# EAGLE board Star Motherboard V4 (EAGLE 9.6.2), part 1 of 2
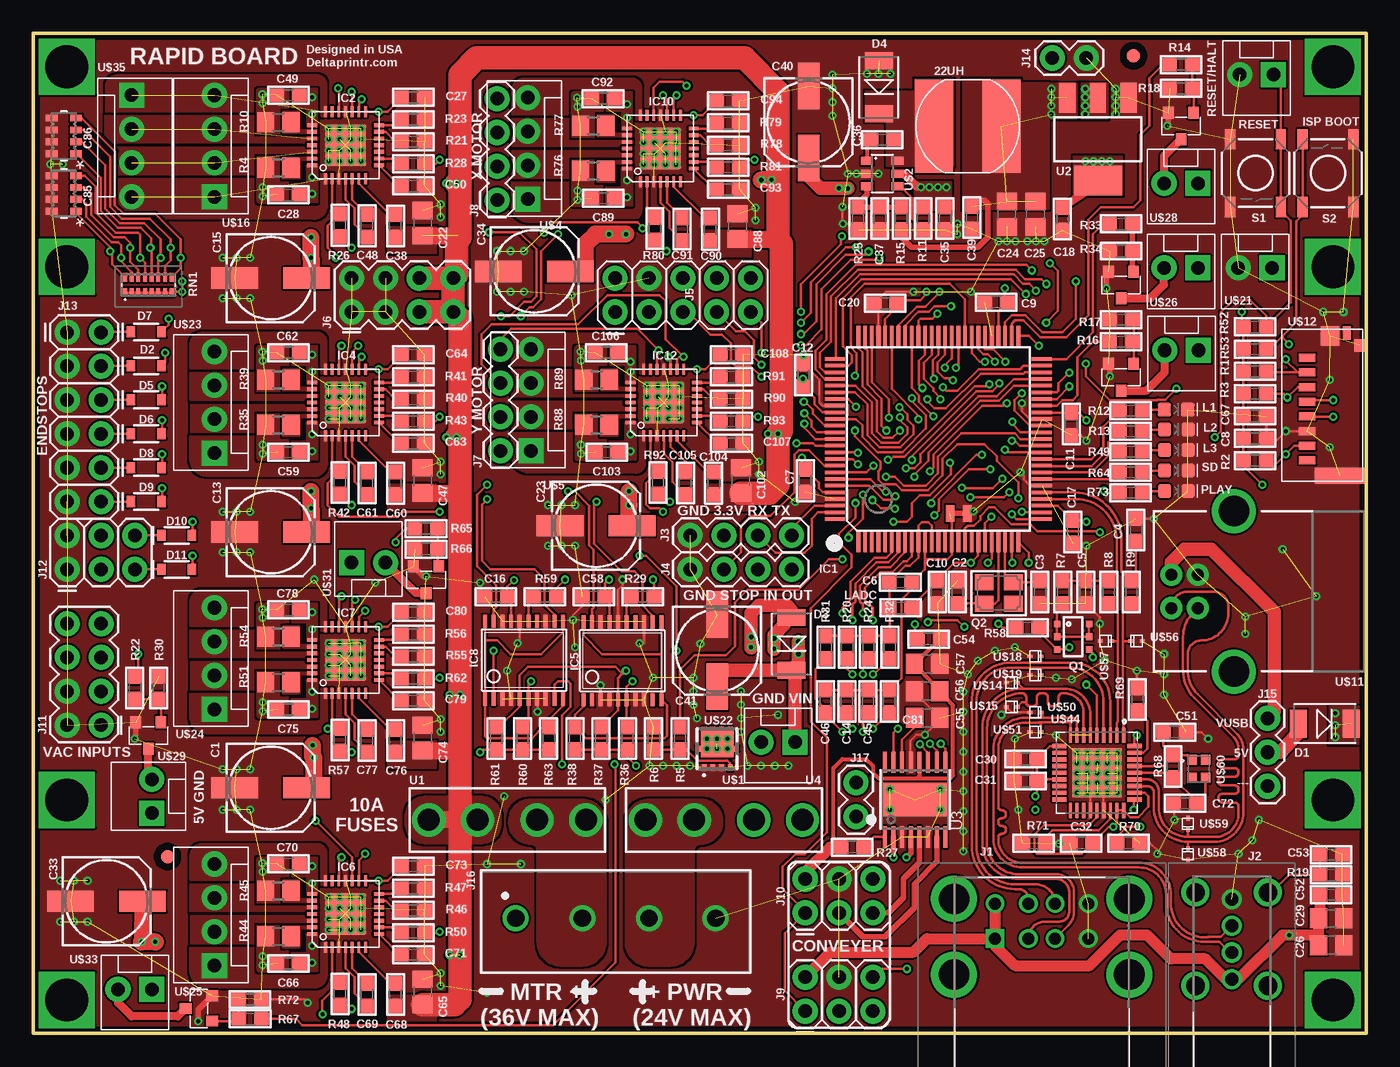
[diagram p9: board, top side]
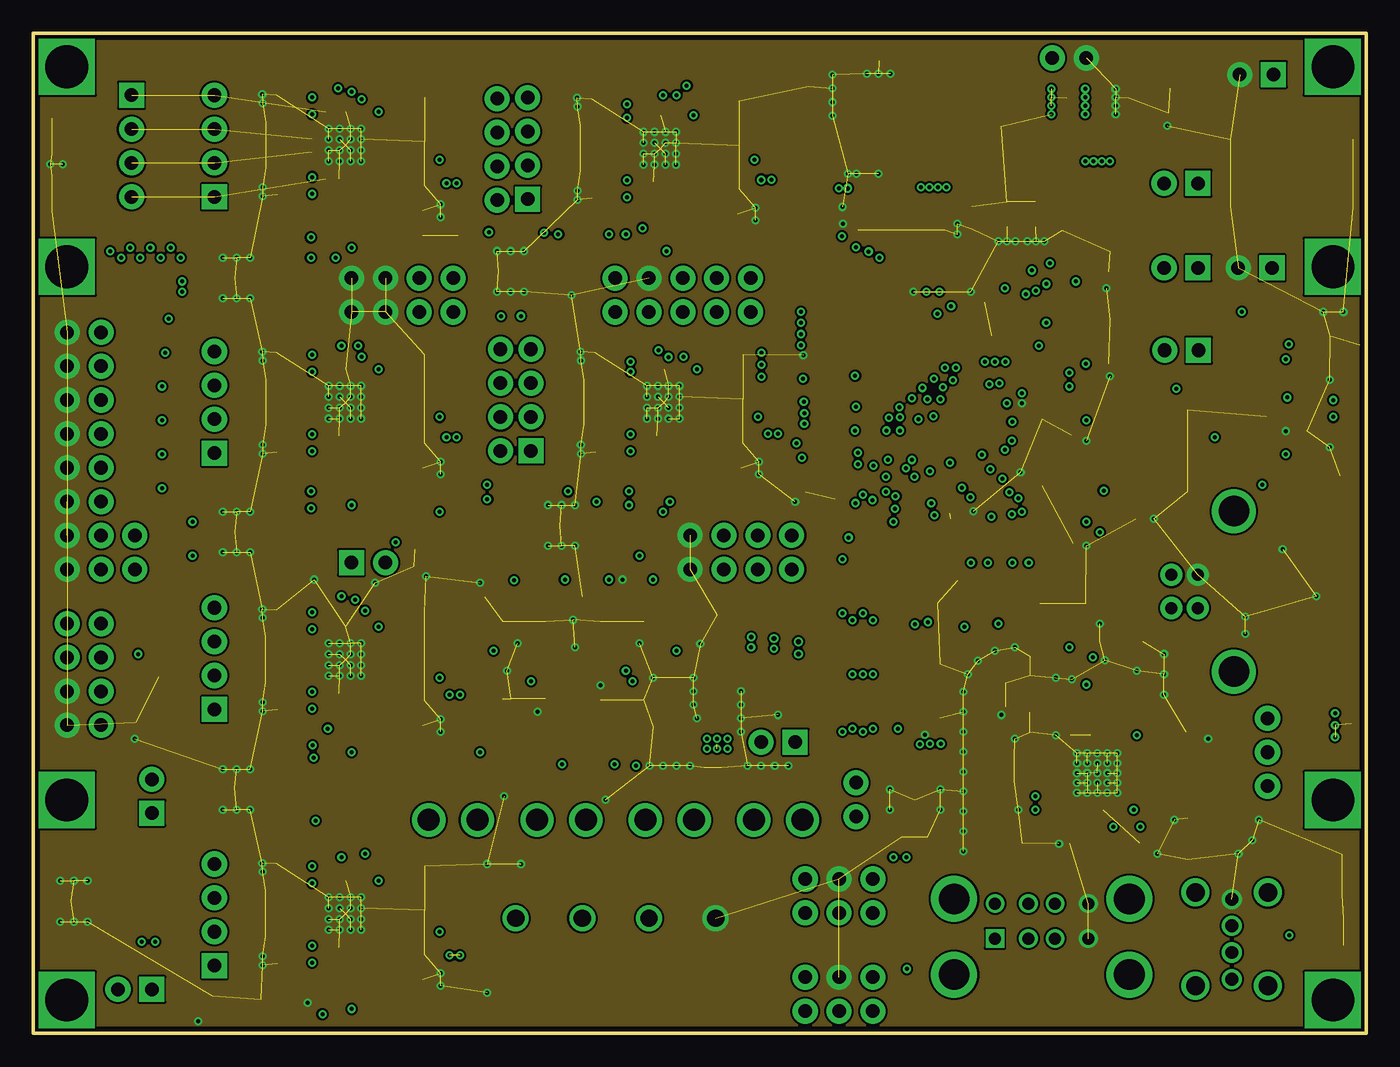
[diagram p10: board, inner layer GND]
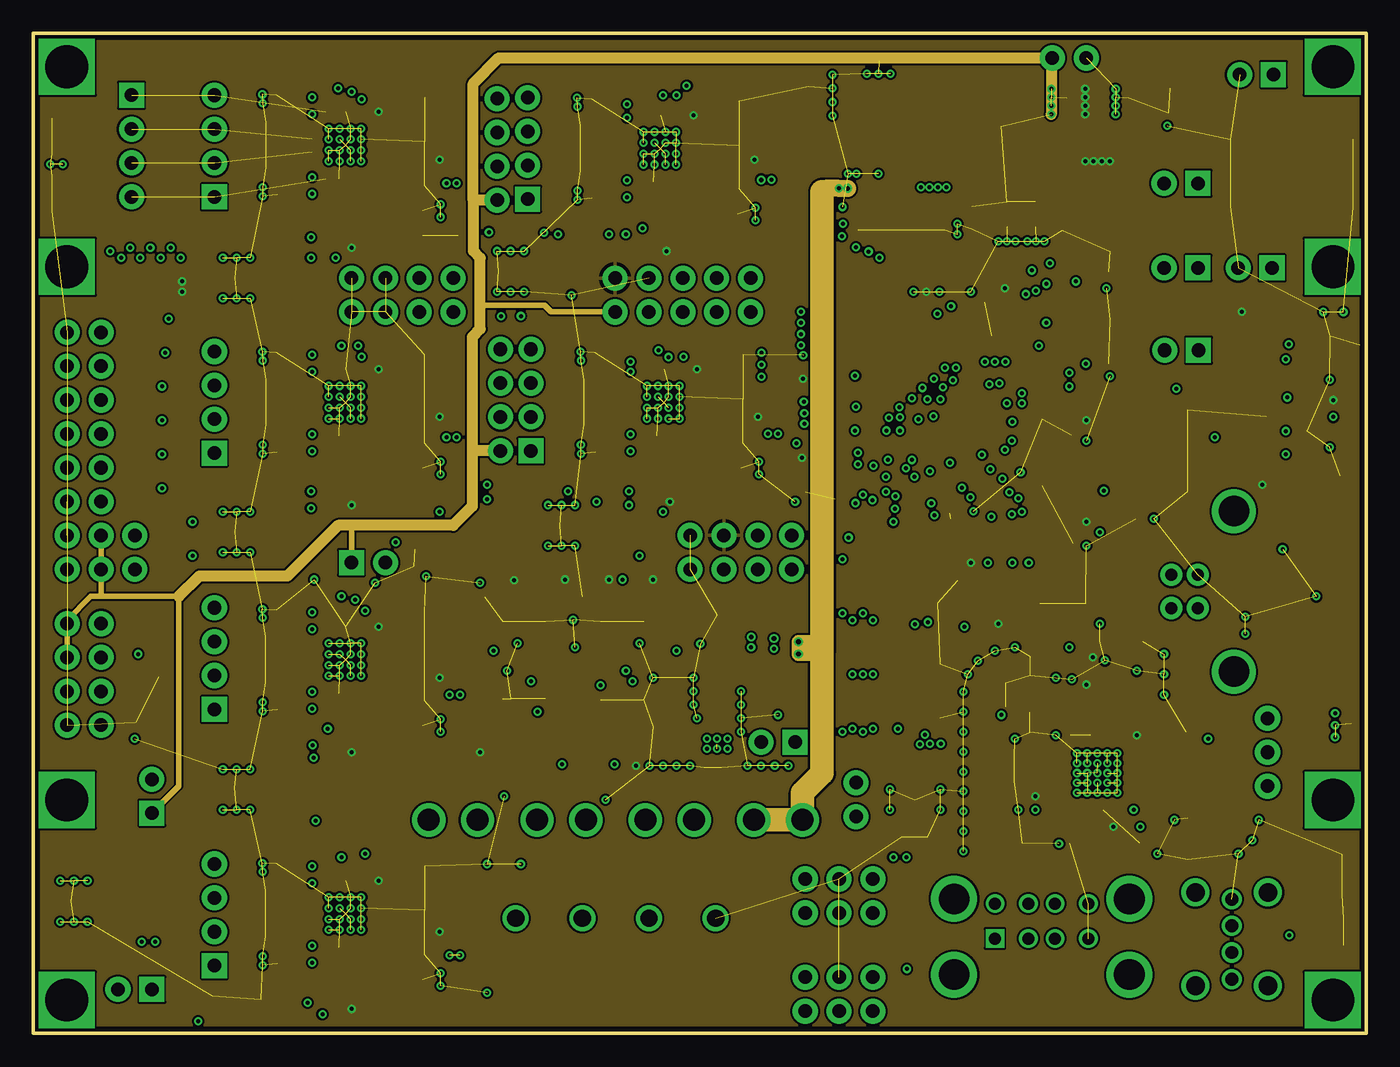
[diagram p11: board, inner layer VCC]
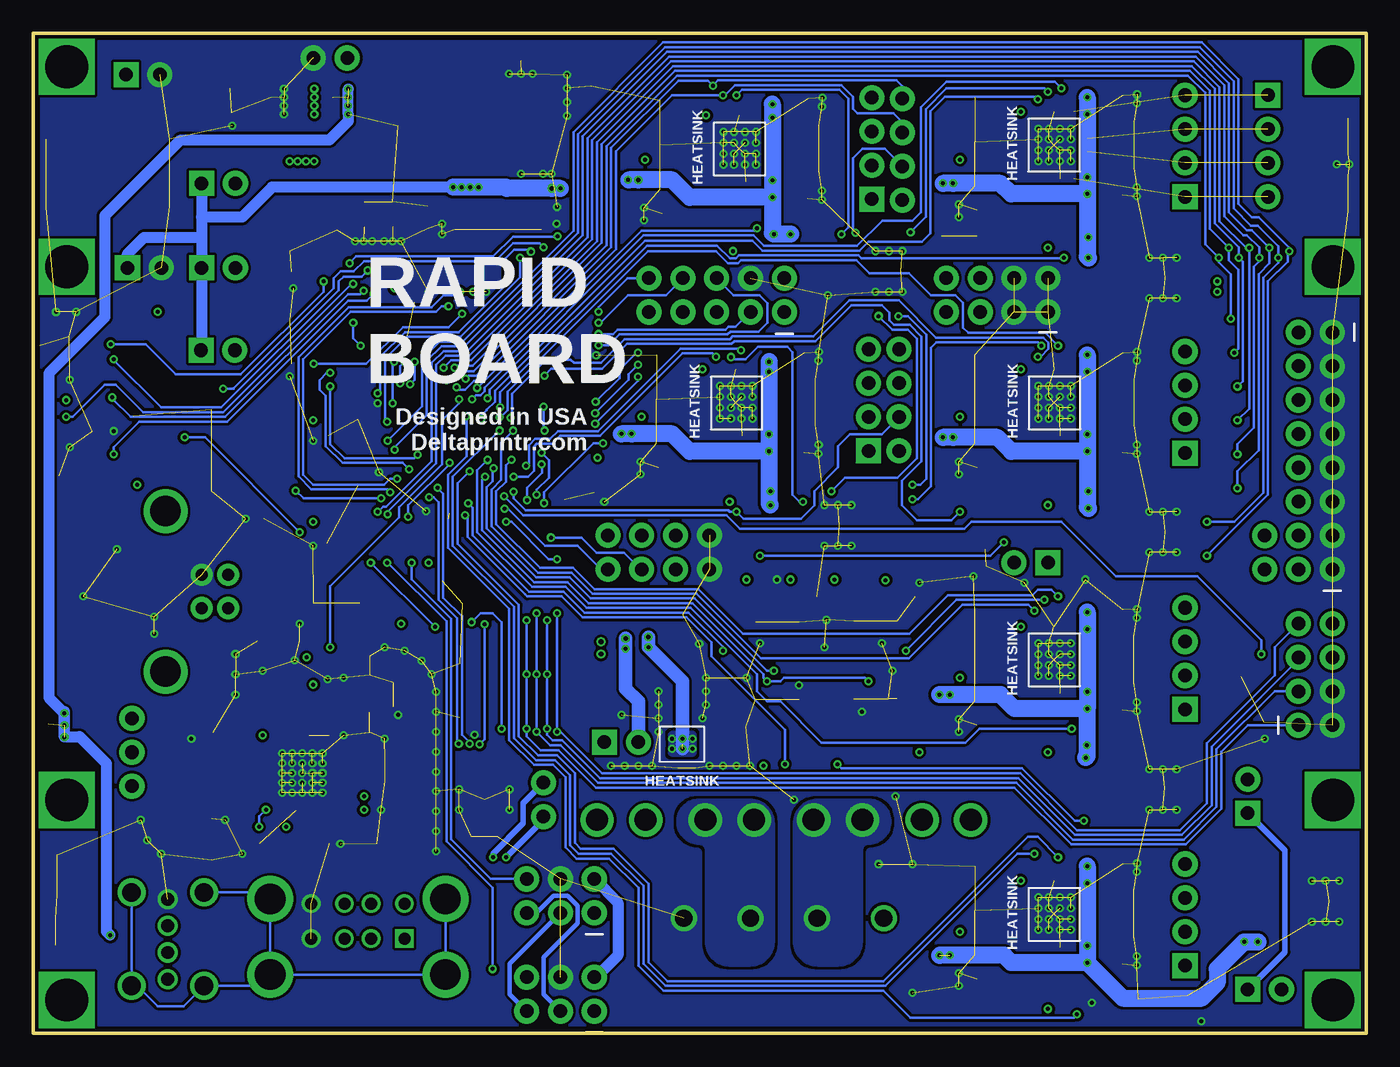
[diagram p12: board, bottom side, seen from below]

Size 100 x 75 mm. Coordinates in mm from the lower left corner, seen from the top.
Outline: 0,75 0,0 100,0 100,75 0,75
Copper layers (1*2*15*16): Top 0.035559375mm / dielectric 0.17018125mm / GND 0.01778125mm / dielectric 47mil / VCC 0.01778125mm / dielectric 0.17018125mm / Bottom 0.035559375mm
Design rules "OSHPark-4layer": minimum track width 6mil, minimum drill 0.3mm, track to track 6mil, track to pad 6mil, pad to pad 6mil, via to via 6mil, smd to smd 0mil, copper to edge 15mil, drill to drill 6mil, minimum pad ring 4mil, minimum via ring 6mil, stop-mask expansion 2.5mil, vias tented up to drill 20mil, thermal gap 10mil
Net classes: 1 DP/DM: width 0.203 mm; 5 3.3-Amp Class: width 1.27 mm

## Footprints (pad centres in the part's own frame; a part is rotated, then mirrored left to right if it is on the bottom)
CD75 = smd 7 x 2.85: 1 0,2.54; 2 0,-2.54
153CLV-0605 = smd 3.5 x 1.6: + 2.7,0; - -2.7,0
CAP_0603 = smd 1.1 x 1: 1 -0.85,0; 2 0.85,0
C0805 = smd 1.3 x 1.5: 1 -0.95,0; 2 0.95,0
CA064_KEM = smd 0.889 x 0.508: 1 -0.914,1.333; 2 -0.914,0.445; 3 -0.914,-0.445; 4 -0.914,-1.333; 5 0.914,-1.333; 6 0.914,-0.445; 7 0.914,0.445; 8 0.914,1.333
DO-214AC = smd 1.27 x 2.1: 1 -1.98,0; 2 1.98,0
SOD-323 = smd 0.63 x 0.83: A 1.15,0; C -1.15,0
LPC1769 = smd 0.27 x 1.5: 1 -6,-7.75; 2 -5.5,-7.75; 3 -5,-7.75; 4 -4.5,-7.75; 5 -4,-7.75; 6 -3.5,-7.75; 7 -3,-7.75; 8 -2.5,-7.75; 9 -2,-7.75; 10 -1.5,-7.75; 11 -1,-7.75; 12 -0.5,-7.75; 13 0,-7.75; 14 0.5,-7.75; 15 1,-7.75; 16 1.5,-7.75; 17 2,-7.75; 18 2.5,-7.75; 19 3,-7.75; 20 3.5,-7.75; 21 4,-7.75; 22 4.5,-7.75; 23 5,-7.75; 24 5.5,-7.75; 25 6,-7.75; 51 6,7.75; 52 5.5,7.75; 53 5,7.75; 54 4.5,7.75; 55 4,7.75; 56 3.5,7.75; 57 3,7.75; 58 2.5,7.75; 59 2,7.75; 60 1.5,7.75; 61 1,7.75; 62 0.5,7.75; 63 0,7.75; 64 -0.5,7.75; 65 -1,7.75; 66 -1.5,7.75; 67 -2,7.75; 68 -2.5,7.75; 69 -3,7.75; 70 -3.5,7.75; 71 -4,7.75; 72 -4.5,7.75; 73 -5,7.75; 74 -5.5,7.75; 75 -6,7.75 | smd 1.5 x 0.27: 26 7.75,-6; 27 7.75,-5.5; 28 7.75,-5; 29 7.75,-4.5; 30 7.75,-4; 31 7.75,-3.5; 32 7.75,-3; 33 7.75,-2.5; 34 7.75,-2; 35 7.75,-1.5; 36 7.75,-1; 37 7.75,-0.5; 38 7.75,0; 39 7.75,0.5; 40 7.75,1; 41 7.75,1.5; 42 7.75,2; 43 7.75,2.5; 44 7.75,3; 45 7.75,3.5; 46 7.75,4; 47 7.75,4.5; 48 7.75,5; 49 7.75,5.5; 50 7.75,6; 76 -7.75,6; 77 -7.75,5.5; 78 -7.75,5; 79 -7.75,4.5; 80 -7.75,4; 81 -7.75,3.5; 82 -7.75,3; 83 -7.75,2.5; 84 -7.75,2; 85 -7.75,1.5; 86 -7.75,1; 87 -7.75,0.5; 88 -7.75,0; 89 -7.75,-0.5; 90 -7.75,-1; 91 -7.75,-1.5; 92 -7.75,-2; 93 -7.75,-2.5; 94 -7.75,-3; 95 -7.75,-3.5; 96 -7.75,-4; 97 -7.75,-4.5; 98 -7.75,-5; 99 -7.75,-5.5; 100 -7.75,-6
QFN28-PAD = smd 0.8 x 0.26: 1 -2.5,1.5; 2 -2.5,1; 3 -2.5,0.5; 4 -2.5,0; 5 -2.5,-0.5; 6 -2.5,-1; 7 -2.5,-1.5; 15 2.5,-1.5; 16 2.5,-1; 17 2.5,-0.5; 18 2.5,0; 19 2.5,0.5; 20 2.5,1; 21 2.5,1.5 | smd 0.26 x 0.8: 8 -1.5,-2.5; 9 -1,-2.5; 10 -0.5,-2.5; 11 0,-2.5; 12 0.5,-2.5; 13 1,-2.5; 14 1.5,-2.5; 22 1.5,2.5; 23 1,2.5; 24 0.5,2.5; 25 0,2.5; 26 -0.5,2.5; 27 -1,2.5; 28 -1.5,2.5 | smd 3.1 x 3.1: TP 0,0
TSSOP20 = smd 0.305 x 0.991: 1 -2.925,-2.918; 2 -2.275,-2.918; 3 -1.625,-2.918; 4 -0.975,-2.918; 5 -0.325,-2.918; 6 0.325,-2.918; 7 0.975,-2.918; 8 1.625,-2.918; 9 2.275,-2.918; 10 2.925,-2.918; 11 2.925,2.918; 12 2.275,2.918; 13 1.625,2.918; 14 0.975,2.918; 15 0.325,2.918; 16 -0.325,2.918; 17 -0.975,2.918; 18 -1.625,2.918; 19 -2.275,2.918; 20 -2.925,2.918
C2341 = drill 0.9 pad 1.4 square: 1 0,0 | drill 0.9 pad 1.4: 2 2.5,0; 3 4.5,0; 4 7,0; 5 7,2.62; 6 4.5,2.62; 7 2.5,2.62; 8 0,2.62 | drill 2.3 pad 3.45: MH1 -3.07,-2.71; MH2 10.07,-2.71; MH3 10.07,2.97; MH4 -3.07,2.97
737250110BLF = drill 0.97 pad 1.509: 1 0,0; 2 0,2; 3 0,4; 4 0,6 | drill 1.4 pad 2.1: MH1 -2.72,6.5; MH2 2.72,6.5; MH3 2.72,-0.5; MH4 -2.72,-0.5
1X04 = drill 1.016 pad 1.88: 1 0,0; 2 2.54,0; 3 5.08,0; 4 7.62,0
2X5 = drill 1.016 pad 1.88: 1 0,0; 2 0,2.54; 3 2.54,0; 4 2.54,2.54; 5 5.08,0; 6 5.08,2.54; 7 7.62,0; 8 7.62,2.54; 9 10.16,0; 10 10.16,2.54
2X4 = drill 1.016 pad 1.88: 1 -3.81,-1.27; 2 -3.81,1.27; 3 -1.27,-1.27; 4 -1.27,1.27; 5 1.27,-1.27; 6 1.27,1.27; 7 3.81,-1.27; 8 3.81,1.27
2X3 = drill 1.016 pad 1.88: 1 0,0; 2 0,2.54; 3 2.54,0; 4 2.54,2.54; 5 5.08,0; 6 5.08,2.54
2X6 = drill 1.016 pad 1.88: 1 0,0; 2 0,2.54; 3 2.54,0; 4 2.54,2.54; 5 5.08,0; 6 5.08,2.54; 7 7.62,0; 8 7.62,2.54; 9 10.16,0; 10 10.16,2.54; 11 12.7,0; 12 12.7,2.54
1X02 = drill 1.016 pad 1.88: 1 0,0; 2 2.54,0
1X03 = drill 1.016 pad 1.88: 1 0,0; 2 2.54,0; 3 5.08,0
691137710004 = drill 1.3: 1 -7.5,0; 2 -2.5,0; 3 2.5,0; 4 7.5,0
LED-0603 = smd 1 x 1: A -0.877,0; C 0.877,0
SC74_INFINEON = smd 0.5 x 0.5: 1 -0.95,-1.2; 2 0,-1.2; 3 0.95,-1.2; 4 0.95,1.2; 5 0,1.2; 6 -0.95,1.2
CRYSTAL_3.2X2.5 = smd 1.4 x 1.2: 1 -1.1,-0.8; 2 1.1,0.8; GND1 -1.1,0.8; GND2 1.1,-0.8
RESISTOR_0603 = smd 1.1 x 1: 1 -0.85,0; 2 0.85,0
R0805 = smd 1.3 x 1.5: 1 -0.95,0; 2 0.95,0
YC248JR0710KL = smd 0.3 x 0.65: 1 -1.75,-0.575; 2 -1.75,0.575; 3 -1.25,-0.575; 4 -1.25,0.575; 5 -0.75,-0.575; 6 -0.75,0.575; 7 -0.25,-0.575; 8 -0.25,0.575; 9 0.25,-0.575; 10 0.25,0.575; 11 0.75,-0.575; 12 0.75,0.575; 13 1.25,-0.575; 14 1.25,0.575; 15 1.75,-0.575; 16 1.75,0.575
SWITCH_MOMENTARY = smd 1.524 x 0.762: 1 -2.54,1.905; 2 2.54,1.905; 3 -2.54,-1.905; 4 2.54,-1.905
2PT_GND_TIE = smd 1.27 x 0.635: P$1 0,0.635; P$2 0,-0.635
3544-2 = drill 1.65 pad 2.5: 1 -5.895,0; 2 -2.235,0; 3 2.235,0; 4 5.895,0
SOT223 = smd 1.219 x 2.235: 1 -2.311,-3.099; 2 0,-3.099; 3 2.311,-3.099 | smd 3.6 x 2.2: 4 0,3.099
DRV8833 = smd 0.3 x 1.6: P$1 -2.275,-2.8; P$2 -1.625,-2.8; P$3 -0.975,-2.8; P$4 -0.325,-2.8; P$5 0.325,-2.8; P$6 0.975,-2.8; P$7 1.625,-2.8; P$8 2.275,-2.8; P$9 2.275,2.8; P$10 1.625,2.8; P$11 0.975,2.8; P$12 0.325,2.8; P$13 -0.325,2.8; P$14 -0.975,2.8; P$15 -1.625,2.8; P$16 -2.275,2.8 | smd 4.8 x 2.5: P$17 0,0
CONNECTORS_MOLEX-1X2 = drill 1.016 pad 1.88 square: 1 -1.27,0 | drill 1.016 pad 1.88: 2 1.27,0
SOT23-6 = smd 0.6 x 0.9: 1 -0.95,-1.15; 2 0,-1.15; 3 0.95,-1.15; 4 0.95,1.15; 5 0,1.15; 6 -0.95,1.15
CONNECTORS_MOLEX-1X4 = drill 1.016 pad 1.88 square: 1 -3.81,0 | drill 1.016 pad 1.88: 2 -1.27,0; 3 1.27,0; 4 3.81,0
FIDUCIAL_1MM = smd 1 x 1: 1 0,0
USB-B-PTH = drill 0.914 pad 1.676: D+ 2.54,1.25; D- 4.521,1.25; GND 2.54,-1.25; VBUS 4.521,-1.25 | drill 2.286: S1 -0.178,-6.02; S2 -0.178,6.02
MICROSD_PUSH-PULL = smd 1.2 x 3.79: G1 -5,-2.48 | smd 1.45 x 1.4: G2 5.475,-1.725 | smd 1 x 0.6: G3 5.7,-2.975 | smd 0.95 x 0.85: G4 4.774,-3.95 | smd 0.6 x 1.25: PIN1 3.85,0; PIN2 2.75,0; PIN3 1.65,0; PIN4 0.55,0; PIN5 -0.55,0; PIN6 -1.65,0; PIN7 -2.75,0; PIN8 -3.85,0
MOSFET_DMN3404L-7 = smd 0.8 x 0.9: P$1 0,0; P$2 0.95,-2; P$3 -0.95,-2
DIODE_ESD_ESD9B3.3ST5G = smd 0.36 x 0.25: 1 -0.42,0; 2 0.42,0
MOSFET_AON7524 = smd 0.35 x 0.5: 1 -0.975,-1.4; 2 -0.325,-1.4; 3 0.325,-1.4; 4 0.975,-1.4 | smd 0.4 x 0.3: 5 0.975,1.5; 6 0.325,1.5; 7 -0.325,1.5; 8 -0.975,1.5 | smd 0.38 x 0.43: 9 -1.415,0; 11 1.415,0 | smd 2.45 x 1.98: 10 0,0.36
USB_HUB_2.0_4-PORT_USB2514B-I/M2 = smd 1.1 x 0.26: 1 -2.815,2; 2 -2.815,1.5; 3 -2.815,1; 4 -2.815,0.5; 5 -2.815,0; 6 -2.815,-0.5; 7 -2.815,-1; 8 -2.815,-1.5; 9 -2.815,-2; 19 2.815,-2; 20 2.815,-1.5; 21 2.815,-1; 22 2.815,-0.5; 23 2.815,0; 24 2.815,0.5; 25 2.815,1; 26 2.815,1.5; 27 2.815,2 | smd 0.26 x 1.1: 10 -2,-2.815; 11 -1.5,-2.815; 12 -1,-2.815; 13 -0.5,-2.815; 14 0,-2.815; 15 0.5,-2.815; 16 1,-2.815; 17 1.5,-2.815; 18 2,-2.815; 28 2,2.815; 29 1.5,2.815; 30 1,2.815; 31 0.5,2.815; 32 0,2.815; 33 -0.5,2.815; 34 -1,2.815; 35 -1.5,2.815; 36 -2,2.815 | smd 3.7 x 3.7: 37 0,0
CRYSTAL_XRCGB24M000F0L00R0 = smd 0.7 x 0.75: 1 -0.5,0.675; 2 -0.5,-0.675; 3 0.5,-0.675; 4 0.5,0.675

## Placement (x,y rotation side)
22UH  22uH  [CD75]  70.11,68.03 270 top
C1  100uF/35V  [153CLV-0605]  17.81,18.41 0 top
C2  12pF  [CAP_0603]  69.34,33.09 90 top
C3  12pF  [CAP_0603]  75.53,33.09 270 top
C4  18pF  [CAP_0603]  82.72,37.75 270 top
C5  18pF  [CAP_0603]  78.96,33.09 90 top
C6  0.1uF  [CAP_0603]  65.06,33.83 0 top
C7  0.1uF  [CAP_0603]  57.93,41.45 90 top
C8  0.1uF  [CAP_0603]  91.65,44.63 180 top
C9  0.1uF  [CAP_0603]  72.23,54.83 0 top
C10  0.1uF  [CAP_0603]  67.82,33.09 90 top
C11  0.1uF  [CAP_0603]  77.88,45.69 90 top
C12  0.1uF  [CAP_0603]  57.77,49.37 270 top
C13  100uF/35V  [153CLV-0605]  17.81,37.59 0 top
C14  10uF  [CAP_0603]  61.03,24.89 90 top
C15  100uF/35V  [153CLV-0605]  17.81,56.64 0 top
C16  0.1uF  [CAP_0603]  34.71,32.74 0 top
C17  0.1uF  [CAP_0603]  78,37.61 90 top
C18  10uF  [CAP_0603]  77.22,61.09 270 top
C20  0.1uF  [CAP_0603]  63.92,54.74 0 top
C22  1u/50V  [C0805]  29.21,60.77 90 top
C23  100uF/35V  [153CLV-0605]  42.22,38.06 0 top
C24  10uF  [C0805]  73.03,61.43 270 top
C25  10uF  [C0805]  75.18,61.43 270 top
C26  10uF  [C0805]  97.37,6.6 180 top
C27  0.1uF  [CAP_0603]  28.51,70.2 180 top
C28  0.1uF  [CAP_0603]  19.14,62.89 180 top
C29  10uF  [C0805]  97.37,8.62 180 top
C30  0.1uF  [CAP_0603]  74.44,20.57 180 top
C31  0.1uF  [CAP_0603]  74.44,18.92 180 top
C32  0.1uF  [CAP_0603]  78.61,14.27 180 top
C33  100uF/35V  [153CLV-0605]  5.49,9.91 0 top
C34  100uF/35V  [153CLV-0605]  37.59,57.15 0 top
C35  0.1uF  [CAP_0603]  68.39,61.12 270 top
C36  0.1uF  [CAP_0603]  63.7,67.02 180 top
C37  18pF  [CAP_0603]  63.5,61.12 270 top
C38  0.1uF  [CAP_0603]  27.17,60.56 90 top
C39  0.1uF  [CAP_0603]  70.41,61.18 270 top
C40  100uF/35V  [153CLV-0605]  58.16,68.35 270 top
C41  100uF/35V  [153CLV-0605]  51.31,28.7 270 top
C45  10uF  [CAP_0603]  62.63,24.89 90 top
C46  10uF  [CAP_0603]  59.44,24.89 90 top
C47  1u/50V  [C0805]  29.21,41.46 90 top
C48  22n/50V  [CAP_0603]  25.04,60.57 90 top
C49  0.1uF  [CAP_0603]  19.12,70.36 180 top
C50  2.2uF/6V3  [CAP_0603]  28.5,63.55 180 top
C51  18pF  [CAP_0603]  85.64,22.59 0 top
C52  0.1uF  [CAP_0603]  97.37,10.38 0 top
C53  1nF  [CAP_0603]  97.37,13.4 180 top
C54  0.1uF  [CAP_0603]  67.18,29.57 180 top
C55  10uF  [C0805]  67.07,23.65 0 top
C56  10uF  [C0805]  67.06,25.66 180 top
C57  10uF  [C0805]  67.06,27.71 0 top
C58  0.1uF  [CAP_0603]  42.05,32.74 0 top
C59  0.1uF  [CAP_0603]  19.14,43.59 180 top
C60  0.1uF  [CAP_0603]  27.17,41.25 90 top
C61  22n/50V  [CAP_0603]  25.04,41.27 90 top
C62  0.1uF  [CAP_0603]  19.12,51.06 180 top
C63  2.2uF/6V3  [CAP_0603]  28.5,44.25 180 top
C64  0.1uF  [CAP_0603]  28.51,50.89 180 top
C65  1u/50V  [C0805]  29.21,3.11 90 top
C66  0.1uF  [CAP_0603]  19.14,5.24 180 top
C67  10uF  [CAP_0603]  91.65,46.3 180 top
C68  0.1uF  [CAP_0603]  27.17,2.9 90 top
C69  22n/50V  [CAP_0603]  25.04,2.91 90 top
C70  0.1uF  [CAP_0603]  19.12,12.7 180 top
C71  2.2uF/6V3  [CAP_0603]  28.5,5.9 180 top
C72  18pF  [CAP_0603]  86.4,17.26 180 top
C73  0.1uF  [CAP_0603]  28.51,12.54 180 top
C74  1u/50V  [C0805]  29.21,22.16 90 top
C75  0.1uF  [CAP_0603]  19.14,24.29 180 top
C76  0.1uF  [CAP_0603]  27.17,21.95 90 top
C77  22n/50V  [CAP_0603]  25.04,21.96 90 top
C78  0.1uF  [CAP_0603]  19.12,31.75 180 top
C79  2.2uF/6V3  [CAP_0603]  28.5,24.95 180 top
C80  0.1uF  [CAP_0603]  28.51,31.59 180 top
C81  10uF  [CAP_0603]  64.23,24.89 90 top
C85  CAP_ARRAY_CA064C104M4RAC7800  [CA064_KEM]  2.29,62.99 180 top
C86  CAP_ARRAY_CA064C104M4RAC7800  [CA064_KEM]  2.29,67.31 180 top
C88  1u/50V  [C0805]  52.83,60.51 90 top
C89  0.1uF  [CAP_0603]  42.76,62.64 180 top
C90  0.1uF  [CAP_0603]  50.79,60.3 90 top
C91  22n/50V  [CAP_0603]  48.66,60.32 90 top
C92  0.1uF  [CAP_0603]  42.75,70.11 180 top
C93  2.2uF/6V3  [CAP_0603]  52.13,63.3 180 top
C94  0.1uF  [CAP_0603]  52.13,69.94 180 top
C102  1u/50V  [C0805]  53.09,41.46 90 top
C103  0.1uF  [CAP_0603]  43.01,43.59 180 top
C104  0.1uF  [CAP_0603]  51.05,41.25 90 top
C105  22n/50V  [CAP_0603]  48.92,41.27 90 top
C106  0.1uF  [CAP_0603]  43,51.06 180 top
C107  2.2uF/6V3  [CAP_0603]  52.38,44.25 180 top
C108  0.1uF  [CAP_0603]  52.38,50.89 180 top
D1  B260A-13-F  [DO-214AC]  96.9,23.22 180 top
D2  1N4148WSTR  [SOD-323]  8.47,50.06 0 top
D3  B260A-13-F  [DO-214AC]  56.9,29.21 90 top
D4  B260A-13-F  [DO-214AC]  63.44,70.96 90 top
D5  1N4148WSTR  [SOD-323]  8.47,47.52 0 top
D6  1N4148WSTR  [SOD-323]  8.47,44.97 0 top
D7  1N4148WSTR  [SOD-323]  8.47,52.6 0 top
D8  1N4148WSTR  [SOD-323]  8.47,42.43 0 top
D9  1N4148WSTR  [SOD-323]  8.47,39.89 0 top
D10  1N4148WSTR  [SOD-323]  10.76,37.34 0 top
D11  1N4148WSTR  [SOD-323]  10.76,34.8 0 top
IC1  LPC1769  [LPC1769]  67.9,44.57 0 top
IC2  TMC2208  [QFN28-PAD]  23.43,66.61 90 top
IC4  TMC2208  [QFN28-PAD]  23.43,47.31 90 top
IC5  MCP44X1  [TSSOP20]  44.2,27.94 0 top
IC6  TMC2208  [QFN28-PAD]  23.43,8.95 90 top
IC7  TMC2208  [QFN28-PAD]  23.43,28 90 top
IC8  MCP44X1  [TSSOP20]  36.82,27.99 0 top
IC10  TMC2208  [QFN28-PAD]  47.05,66.36 90 top
IC12  TMC2208  [QFN28-PAD]  47.3,47.31 90 top
J1  C2341  [C2341]  72.16,7.11 0 top
J2  73725-0110BLF  [737250110BLF]  89.92,4.06 0 top
J3  [1X04]  49.28,37.34 0 top
J4  [1X04]  49.28,34.8 0 top
J5  [2X5]  43.65,54.1 0 top
J6  [2X4]  27.69,55.37 0 top
J7  [1X04]  35.05,43.69 90 top
J8  [1X04]  34.8,62.48 90 top
J9  [2X3]  57.91,1.67 0 top
J10  [2X3]  57.91,9.04 0 top
J11  [2X4]  3.81,26.92 90 top
J12  FEMALE 2x3  [2X3]  2.54,34.8 0 top
J13  2X6 FEMALE  [2X6]  2.54,52.58 270 top
J14  [1X02]  76.45,73.15 0 top
J15  [1X03]  92.6,23.62 270 top
J16  [691137710004]  43.69,8.64 0 top
J17  [1X02]  61.72,16.26 90 top
L1  GREEN  [LED-0603]  85.73,46.78 0 top
L2  GREEN  [LED-0603]  85.75,45.28 0 top
L3  GREEN  [LED-0603]  85.75,43.75 0 top
LADC  39NH 300mah  [CAP_0603]  65.07,31.91 180 top
LED10  GREEN  [LED-0603]  85.75,40.67 0 top
Q1  BSL207SP  [SC74_INFINEON]  78.01,29.75 270 top
Q2  12MHz ABM8G-106-12.000MHZ-T  [CRYSTAL_3.2X2.5]  72.43,33.01 180 top
R1  10K  [RESISTOR_0603]  91.65,49.64 180 top
R2  10K  [RESISTOR_0603]  91.65,42.96 180 top
R3  10K  [RESISTOR_0603]  91.65,47.97 180 top
R4  R0805/0R11 .5W  [R0805]  18.39,64.93 0 top
R5  10R  [RESISTOR_0603]  48.51,22.13 270 top
R6  10K  [RESISTOR_0603]  46.55,22.13 270 top
R7  1.5k  [RESISTOR_0603]  77.25,33.09 270 top
R8  33R  [RESISTOR_0603]  80.68,33.09 90 top
R9  33R  [RESISTOR_0603]  82.39,33.09 90 top
R10  R0805/0R11 .5W  [R0805]  18.39,68.34 0 top
R11  49.9k/1%  [RESISTOR_0603]  66.76,61.12 90 top
R12  1k  [RESISTOR_0603]  82.33,46.7 180 top
R13  1k  [RESISTOR_0603]  82.33,45.16 180 top
R14  10R  [RESISTOR_0603]  86.11,72.64 0 top
R15  49.9k/1%  [RESISTOR_0603]  65.13,61.12 90 top
R16  10R  [RESISTOR_0603]  81.6,51.86 0 top
R17  10K  [RESISTOR_0603]  81.6,53.51 0 top
R18  10K  [RESISTOR_0603]  86.11,70.87 0 top
R19  1Mohm  [RESISTOR_0603]  97.37,11.89 180 top
R20  4K7  [RESISTOR_0603]  61.07,28.96 90 top
R21  20k  [RESISTOR_0603]  28.5,66.88 180 top
R22  10R  [RESISTOR_0603]  7.62,25.91 270 top
R23  20k  [RESISTOR_0603]  28.5,68.54 180 top
R24  4K7  [RESISTOR_0603]  62.67,28.96 90 top
R25  9.53k/1%  [RESISTOR_0603]  61.87,61.12 270 top
R26  20k  [RESISTOR_0603]  23,60.61 90 top
R27  10K  [RESISTOR_0603]  61.45,13.97 180 top
R28  1k  [RESISTOR_0603]  28.5,65.22 180 top
R29  100K  [RESISTOR_0603]  45.72,32.74 0 top
R30  10K  [RESISTOR_0603]  9.4,25.91 270 top
R31  4K7  [RESISTOR_0603]  59.47,28.96 90 top
R32  4K7  [RESISTOR_0603]  64.26,28.96 90 top
R33  10R  [RESISTOR_0603]  81.6,60.71 0 top
R34  10K  [RESISTOR_0603]  81.6,58.67 0 top
R35  R0805/0R11 .5W  [R0805]  18.39,45.63 0 top
R36  2.2k  [RESISTOR_0603]  44.58,22.13 270 top
R37  2.2k  [RESISTOR_0603]  42.61,22.13 270 top
R38  5k  [RESISTOR_0603]  40.64,22.13 270 top
R39  R0805/0R11 .5W  [R0805]  18.39,49.03 0 top
R40  20k  [RESISTOR_0603]  28.5,47.57 180 top
R41  20k  [RESISTOR_0603]  28.5,49.23 180 top
R42  20k  [RESISTOR_0603]  23,41.3 90 top
R43  1k  [RESISTOR_0603]  28.5,45.91 180 top
R44  R0805/0R11 .5W  [R0805]  18.39,7.28 0 top
R45  R0805/0R11 .5W  [R0805]  18.39,10.68 0 top
R46  20k  [RESISTOR_0603]  28.5,9.22 180 top
R47  20k  [RESISTOR_0603]  28.5,10.88 180 top
R48  20k  [RESISTOR_0603]  23,2.95 90 top
R49  1k  [RESISTOR_0603]  82.33,43.63 180 top
R50  1k  [RESISTOR_0603]  28.5,7.56 180 top
R51  R0805/0R11 .5W  [R0805]  18.39,26.33 0 top
R52  10K  [RESISTOR_0603]  91.65,52.99 180 top
R53  10K  [RESISTOR_0603]  91.65,51.31 180 top
R54  R0805/0R11 .5W  [R0805]  18.39,29.73 0 top
R55  20k  [RESISTOR_0603]  28.5,28.27 180 top
R56  20k  [RESISTOR_0603]  28.5,29.93 180 top
R57  20k  [RESISTOR_0603]  23,22 90 top
R58  100K  [RESISTOR_0603]  74.59,30.42 180 top
R59  100K  [RESISTOR_0603]  38.38,32.74 0 top
R60  2.2k  [RESISTOR_0603]  36.7,22.13 270 top
R61  2.2k  [RESISTOR_0603]  34.73,22.13 270 top
R62  1k  [RESISTOR_0603]  28.5,26.61 180 top
R63  5k  [RESISTOR_0603]  38.67,22.13 270 top
R64  1k  [RESISTOR_0603]  82.33,42.09 180 top
R65  10R  [RESISTOR_0603]  29.46,37.85 0 top
R66  10K  [RESISTOR_0603]  29.46,36.32 0 top
R67  10R  [RESISTOR_0603]  16.27,1.09 180 top
R68  1Mohm  [RESISTOR_0603]  85.51,20.01 90 top
R69  12K/1%  [RESISTOR_0603]  82.84,25.04 270 top
R70  56K/1%  [RESISTOR_0603]  82.17,14.27 180 top
R71  56K/1%  [RESISTOR_0603]  75.06,14.27 0 top
R72  10K  [RESISTOR_0603]  16.26,2.54 180 top
R73  1k  [RESISTOR_0603]  82.33,40.55 180 top
R76  R0805/0R11 .5W  [R0805]  42.01,64.68 0 top
R77  R0805/0R11 .5W  [R0805]  42.01,68.08 0 top
R78  20k  [RESISTOR_0603]  52.13,66.62 180 top
R79  20k  [RESISTOR_0603]  52.13,68.28 180 top
R80  20k  [RESISTOR_0603]  46.63,60.35 90 top
R81  1k  [RESISTOR_0603]  52.13,64.96 180 top
R88  R0805/0R11 .5W  [R0805]  42.26,45.63 0 top
R89  R0805/0R11 .5W  [R0805]  42.26,49.03 0 top
R90  20k  [RESISTOR_0603]  52.38,47.57 180 top
R91  20k  [RESISTOR_0603]  52.38,49.23 180 top
R92  20k  [RESISTOR_0603]  46.88,41.3 90 top
R93  1k  [RESISTOR_0603]  52.38,45.91 180 top
RN1  YC248-JR-0710KL  [YC248JR0710KL]  8.64,56.13 0 top
S1  SWITCH_MOMENTARY  [SWITCH_MOMENTARY]  91.69,64.52 270 top
S2  SWITCH_MOMENTARY  [SWITCH_MOMENTARY]  97.13,64.51 90 top
SD  GREEN  [LED-0603]  85.75,42.21 0 top
SUPPLY10  2PT_GND_TIE  [2PT_GND_TIE]  69.41,38.99 90 top
U1  3544-2  [3544-2]  35.56,16 180 top
U2  LM1117  [SOT223]  79.87,67.06 180 top
U3  DRV8833PWPR  [DRV8833]  66.16,17.53 0 top
U4  3544-2  [3544-2]  51.82,16 0 top
U$1  CONNECTORS_MOLEX-1X2  [CONNECTORS_MOLEX-1X2]  55.88,21.84 180 top
U$2  AOZ1282CI  [SOT23-6]  63.7,64.48 270 top
U$3  CONNECTORS_MOLEX-1X2  [CONNECTORS_MOLEX-1X2]  91.77,71.9 180 top
U$4  CONNECTORS_MOLEX-1X4  [CONNECTORS_MOLEX-1X4]  37.09,66.37 90 top
U$5  CONNECTORS_MOLEX-1X4  [CONNECTORS_MOLEX-1X4]  37.34,47.5 90 top
U$7  CONNECTORS_MOLEX-1X2  [CONNECTORS_MOLEX-1X2]  86.15,51.23 180 top
U$9  FIDUCIAL  [FIDUCIAL_1MM]  10.07,13.26 0 top
U$10  FIDUCIAL  [FIDUCIAL_1MM]  82.54,73.32 0 top
U$11  USB-B-PTH  [USB-B-PTH]  89.91,33.14 180 top
U$12  MICROSD_PUSH-PULL  [MICROSD_PUSH-PULL]  95.57,46.82 90 top
U$13  MOSFET_DMN3404L-7  [MOSFET_DMN3404L-7]  81.6,48.21 180 top
U$14  DIODE_ESD_ESD9B3.3ST5G  [DIODE_ESD_ESD9B3.3ST5G]  73.4,26.31 0 top
U$15  DIODE_ESD_ESD9B3.3ST5G  [DIODE_ESD_ESD9B3.3ST5G]  73.4,24.48 0 top
U$16  CONNECTORS_MOLEX-1X4  [CONNECTORS_MOLEX-1X4]  13.59,66.55 90 top
U$18  DIODE_ESD_ESD9B3.3ST5G  [DIODE_ESD_ESD9B3.3ST5G]  75.18,28.28 0 top
U$19  DIODE_ESD_ESD9B3.3ST5G  [DIODE_ESD_ESD9B3.3ST5G]  75.18,26.87 0 top
U$20  MOSFET_DMN3404L-7  [MOSFET_DMN3404L-7]  81.6,55.12 180 top
U$21  CONNECTORS_MOLEX-1X2  [CONNECTORS_MOLEX-1X2]  91.67,57.4 180 top
U$22  MOSFET_AON7524  [MOSFET_AON7524]  51.31,21.34 0 top
U$23  CONNECTORS_MOLEX-1X4  [CONNECTORS_MOLEX-1X4]  13.59,47.33 90 top
U$24  CONNECTORS_MOLEX-1X4  [CONNECTORS_MOLEX-1X4]  13.59,28.11 90 top
U$25  CONNECTORS_MOLEX-1X4  [CONNECTORS_MOLEX-1X4]  13.59,8.89 90 top
U$26  CONNECTORS_MOLEX-1X2  [CONNECTORS_MOLEX-1X2]  86.11,57.4 180 top
U$27  MOSFET_DMN3404L-7  [MOSFET_DMN3404L-7]  86.11,67.06 180 top
U$28  CONNECTORS_MOLEX-1X2  [CONNECTORS_MOLEX-1X2]  86.11,63.75 180 top
U$29  CONNECTORS_MOLEX-1X2  [CONNECTORS_MOLEX-1X2]  8.89,17.78 90 top
U$30  MOSFET_DMN3404L-7  [MOSFET_DMN3404L-7]  8.64,21.34 180 top
U$31  CONNECTORS_MOLEX-1X2  [CONNECTORS_MOLEX-1X2]  25.15,35.31 0 top
U$32  MOSFET_DMN3404L-7  [MOSFET_DMN3404L-7]  29.46,33.02 180 top
U$33  CONNECTORS_MOLEX-1X2  [CONNECTORS_MOLEX-1X2]  7.62,3.3 180 top
U$34  MOSFET_DMN3404L-7  [MOSFET_DMN3404L-7]  11.43,1.87 90 top
U$35  CONNECTORS_MOLEX-1X4  [CONNECTORS_MOLEX-1X4]  7.37,66.55 270 top
U$44  USB_HUB_2.0_4-PORT_USB2514B-I/M2  [USB_HUB_2.0_4-PORT_USB2514B-I/M2]  79.8,19.54 270 top
U$50  DIODE_ESD_ESD9B3.3ST5G  [DIODE_ESD_ESD9B3.3ST5G]  75.18,24.07 0 top
U$51  DIODE_ESD_ESD9B3.3ST5G  [DIODE_ESD_ESD9B3.3ST5G]  75.18,22.6 0 top
U$56  DIODE_ESD_ESD9B3.3ST5G  [DIODE_ESD_ESD9B3.3ST5G]  82.77,29.42 180 top
U$57  DIODE_ESD_ESD9B3.3ST5G  [DIODE_ESD_ESD9B3.3ST5G]  80.46,29.42 0 top
U$58  DIODE_ESD_ESD9B3.3ST5G  [DIODE_ESD_ESD9B3.3ST5G]  86.63,13.42 90 top
U$59  DIODE_ESD_ESD9B3.3ST5G  [DIODE_ESD_ESD9B3.3ST5G]  86.63,15.71 270 top
U$60  CRYSTAL_XRCGB24M000F0L00R0  [CRYSTAL_XRCGB24M000F0L00R0]  87.45,19.84 0 top

## Tracks (layer width: path | path; a pad name or v marks a point on that pad's centre or on a via)
3.3V  (via drill 0.3)
  Top 0.203: IC1.84 59.21,46.57 58.61,47.18 58.61,47.69 C12.2 57.77,49.07 v57.76,49.09 | IC1.54 72.4,54.16 C9.2 72.9,55.01 v72.9,55.88 | IC1.42 75.69,46.54 C11.2 78.43,46.54 v78.99,45.97 | IC1.28 76.88,39.57 C17.2 78.89,38.46 v78.99,38.35 | IC1.19 70.87,36.79 70.87,35.81 v70.36,35.31 69.09,35.31 67.82,34.04 C10.2 65.92,32.04 LADC.1 | C31.1 arc-90 75.41,19.04 U$44.15 | U$44.10 76.26,21.54 C30.1 C31.1 | v78.99,26.16 79.81,25.35 U$44.5 | U$12.PIN4 95.69,47.5 v97.54,47.5 | U$44.29 83.4,18.04 83.67,17.77 83.67,17 82.89,16.22 82.31,16.22 U$44.27 U$44.26 81.3,15.77 v81.03,15.49 80.7,15.49 80.09,14.88 80.08,14.88 C32.1 78.66,13.46 75.3,13.46 75.1,13.66 75.1,14.88 75.82,15.6 79.2,15.6 79.8,16.2 U$44.23 | U$44.36 82.61,22.35 v82.8,22.35 | C31.1 75.29,17.89 v75.18,17.78 | C27.2 26.57,69.11 v25.91,69.11 IC2.15 | C64.2 26.57,49.81 v25.91,49.81 IC4.15 | C80.2 26.57,30.5 v25.91,30.5 IC7.15 | C73.2 26.57,11.45 v25.91,11.45 IC6.15 | C108.2 50.45,49.81 v49.78,49.81 IC12.15 | C94.2 50.19,68.86 v49.53,68.86 IC10.15 | R80.1 47.46,58.67 v47.5,58.67 | R81.1 53.55,65.53 v54.1,65.53 | R28.1 30.16,65.22 v30.48,65.53 | R43.1 30.16,45.91 v30.48,46.23 | R62.1 30.42,26.61 v30.48,26.67 | R50.1 30.42,7.56 v30.48,7.62 | R26.1 23.05,59.76 v23.88,58.93 | R42.1 23.05,40.45 v23.88,39.62 | R57.1 23.81,21.15 v23.88,21.08 | R48.1 23.6,2.1 v23.88,1.83 | R92.1 47.46,39.88 v47.75,39.88 | R93.1 53.55,46.23 v54.36,46.23 | R63.2 R60.2 R61.2 33.72,21.27 v33.53,21.08 | R38.2 R37.2 R36.2 44.58,20.7 v45.21,20.07 | IC5.17 43.22,32.42 C58.2 42.9,33.76 v43.18,34.04 | IC8.17 35.84,32.46 C16.2 35.56,33.48 v36.07,33.99 | R59.2 39.23,33.39 v39.88,34.04
  Top 0.203: v46.48,34.04 46.57,33.95 R29.2 | R58.2 72.7,30.42 v72.39,30.73 | Q1.4 79.5,28.51 v79.5,28.19 | v90.67,54.13 90.67,53.12 R52.2 R53.2 R1.2 R3.2 C67.2 C8.2 R2.2 90.8,42.55 v92.2,41.15 | IC1.96 59.25,40.57 58.93,40.89 58.93,41.3 C7.2 57.66,42.57 v57.66,43.18 | v67.02,55.61 67.02,55.46 66.55,55 65.03,55 C20.2 64.77,54.45 63.9,53.57 IC1.71 | RN1.1 RN1.3 RN1.5 RN1.7 RN1.9 RN1.11 RN1.13 RN1.15 10.45,55.63 v11.18,55.63 v11.18,56.39
  Top 0.61: U2.4 79.06,63.15 C18.1
  other vias: 78.94,65.39 79.55,65.39 80.16,65.39 78.91,70.83 78.91,70.19 78.91,69.56 78.91,68.92 80.78,65.39
  pour Top (no thermals): 80.6,71.23 80.6,68.64 78.65,68.64 78.65,71.23
  pour Top (no thermals): 78.08,62.91 81.68,62.91 81.65,65.76 78.05,65.76
  pour VCC: -12.7,84.33 109.47,84.33 109.47,-17.27 -12.7,-17.27
5V  (via drill 0.3)  (9 unrouted)
  Top 0.305: C54.1 67.94,29.48 C57.1 C56.1 69.01,24.59 69.01,19.32 68.83,19.14 66.29,19.14 | R27.2 60.34,13.97 60.02,14.3 60.02,19.89 60.71,20.57 62.48,20.57 62.99,20.07 62.99,19.56 63.41,19.14 66.29,19.14 | U3.P$12 66.49,19.34 66.29,19.14
  Top 0.406: R15.1 65.13,59.7 65.89,58.94 70.88,58.94 71.63,59.69 71.63,62.23 71.37,62.48 70.87,62.48 C39.1
  Top 0.813: J1.8 J1.1 | J1.1 72.16,6.58 73.66,5.08 79.25,5.08 81.53,7.37 83.57,7.37 85.34,5.59 87.95,5.59 89.47,4.06 J2.1 90.42,4.06 93.73,7.37 v94.23,7.37 96.16,7.37 96.42,7.62 | C52.1 96.52,8.72 C29.2 96.42,7.62 | 96.42,7.62 C26.2 | J9.2 59.8,6.1 66.04,6.1 67.06,7.11 J1.1 | J10.2 57.91,12.08 59.8,13.97 R27.2
  VCC 0.406: U$29.1 10.92,18.54 10.92,32.77 5.08,32.77 | 5.08,32.77 4.32,32.77 2.54,30.99 J11.8 J11.6 | U$31.1 23.88,38.1 | J12.4 J12.3 5.08,32.77 | J5.1 38.86,54.1 38.35,54.61 33.53,54.61
  VCC 0.813: 33.02,62.48 33.02,58.68 33.53,58.17 33.53,54.61 33.53,52.83 32.92,52.23 32.92,43.69 | J8.1 33.02,62.48 | 33.02,62.48 33.01,62.48 33.01,71.23 34.92,73.15 J14.1 76.37,73.07 v76.37,68.92 | J7.1 32.92,43.69 | 10.92,32.77 12.45,34.29 19.05,34.29 22.86,38.1 23.88,38.1 31.5,38.1 32.92,39.52 32.92,43.69
  Bottom 0.406: 57.77,4.21 J9.2 | U$33.1 6.1,6.1 6.1,13.72 U$29.1
  Bottom 0.813: 97.66,24.13 v97.66,22.23 | v97.66,22.23 v97.66,24 98.83,25.17 98.83,49.5 94.63,53.71 94.63,61.33 88.94,67.02 77.77,67.02 76.37,68.41 v76.37,68.92 v76.37,70.83 | v94.23,7.37 94.51,7.65 94.51,20.24 96.52,22.25 97.64,22.25 v97.66,22.23 | J10.2 56.13,9.8 56.13,5.84 57.77,4.21
  other vias: 97.66,23.11 76.37,70.19 76.37,69.56
  pour Top (no thermals): 78.24,68.63 78.24,71.22 75.08,71.22 75.08,68.63
  pour Top (no thermals): 69.77,61.84 76.16,61.84 76.16,71.24 74,71.24 74,71.52 69.77,71.52
  pour Top (no thermals): 99.44,21.72 97.28,21.72 97.28,24.51 99.44,24.51
5VUSB
  Top 1.016: J15.2 93.58,21.08 94.92,22.54 D1.2
!SLEEP
  Top 0.203: R27.1 63.05,14.73 U3.P$1
+5V_1
  Top 0.203: IC2.8 27.48,63.55 C50.2
+5V_2
  Top 0.203: IC4.8 27.48,44.25 C63.2
+5V_3
  Top 0.203: IC7.8 27.48,24.95 C79.2
+5V_4
  Top 0.203: IC6.8 27.48,5.9 C71.2
+5V_5
  Top 0.203: IC10.8 51.1,63.3 C93.2
+5V_6
  Top 0.203: IC12.8 51.36,44.25 C107.2
AGND  (1 unrouted)
  Top 0.203: C46.2 C14.2 C45.2 C81.2 65.11,26.63 65.11,32.52 65.91,33.31 C6.2 66.9,34.82 66.9,35.56 | IC1.11 66.9,35.56 | 66.9,35.56 68.58,35.56 68.9,35.88 IC1.15 68.9,38.43 68.83,38.5 68.83,38.61
AVAILABLE2  (via drill 0.3)
  Top 0.203: IC1.40 75.64,45.58 74.75,45.58 73.61,46.73 73.61,47.47 73.94,47.8 73.96,47.8 v74.17,48.01 | v62.67,58.63 62.42,58.38 60.95,58.38 58.74,56.17 58.74,53.42 57.77,52.45 v57.59,52.45
  Bottom 0.203: v74.17,48.01 73.97,48.21 73.97,50.74 72.11,52.6 68.08,52.6 64.56,56.12 64.56,58.12 63.92,58.77 62.8,58.77 v62.67,58.63 | v57.59,52.45 56.51,52.45 56.18,52.78 48.05,52.78 47.85,52.98 47.31,52.98 J5.3
AVAILABLE6  (via drill 0.3)
  Top 0.203: v61.71,58.96 60.98,58.96 58.35,56.33 58.35,54.05 v57.59,53.29 | IC1.66 66.4,53.45 66.55,53.59 67.45,53.59 v67.82,53.96 | v78.98,50.2 78.98,49.29 80.77,47.5 84.3,47.5 84.34,47.53 84.95,47.53 v85.76,48.35
  Bottom 0.203: v57.59,53.29 57.45,53.29 55.37,55.37 52.54,55.37 J5.8 | v61.71,58.96 62.02,59.27 64,59.27 65.36,57.91 75.18,57.91 75.95,57.14 76.95,57.14 76.96,57.15 77.46,56.65 77.46,55.87 84.96,48.37 84.99,48.35 v85.76,48.35 | v67.82,53.96 68.83,52.95 72.27,52.95 75.02,50.2 v78.98,50.2
AVAILABLE7  (via drill 0.3)
  Top 0.203: v77.72,48.51 76.78,47.57 IC1.44 | v67.36,39.74 67.36,39.98 70.77,43.39 v71.18,43.39 | v48.27,28.7 48.27,33.52 45.97,35.81 v45.47,35.81 | v27.18,36.83 27.18,37.08 27.94,37.85 R65.1
  Bottom 0.203: v67.36,39.74 67.06,39.44 67.06,37.37 62.81,33.12 60.23,33.12 58.65,31.55 50.84,31.55 48.27,28.98 v48.27,28.7 | v71.18,43.39 71.44,43.13 76.66,43.13 77.72,44.2 v77.72,48.51 | v45.47,35.81 28.19,35.81 v27.18,36.83
AVAILABLE8  (via drill 0.3)
  Top 0.203: IC1.51 74.68,52.32 v75.44,51.56 | v75.99,53.3 76.86,54.18 76.86,57.17 v76.28,57.76 | v60.68,59.78 60.6,59.69 60.6,59.17 57.59,56.16 v57.59,54.13
  Bottom 0.203: v75.44,51.56 75.99,52.11 v75.99,53.3 | v76.28,57.76 75.77,58.27 65.51,58.27 64.02,59.75 60.71,59.75 v60.68,59.78 | v57.59,54.13 57.59,54.46 55.41,56.64 J5.10
AVCC
  Top 0.203: R31.2 R20.2 R24.2 R32.2 64.26,31.86 LADC.2 C6.1 65.44,35.05 65.79,35.05 66.4,35.67 IC1.10 66.4,38.08 66.66,38.34 67.14,38.34 67.4,38.08 IC1.12
BRA2
  pour Top (no thermals): 18.73,69.13 18.73,67.53 21.24,67.53 21.24,67.73 19.97,67.73 19.97,69.13
BRA3
  pour Top (no thermals): 18.73,49.82 18.73,48.22 21.24,48.22 21.24,48.43 19.97,48.43 19.97,49.82
BRA4
  pour Top (no thermals): 18.73,11.47 18.73,9.87 21.24,9.87 21.24,10.07 19.97,10.07 19.97,11.47
BRA5
  pour Top (no thermals): 18.73,30.52 18.73,28.92 21.24,28.92 21.24,29.12 19.97,29.12 19.97,30.52
BRA7
  pour Top (no thermals): 42.35,68.87 42.35,67.27 44.86,67.27 44.86,67.48 43.59,67.48 43.59,68.87
BRA9
  pour Top (no thermals): 42.6,49.82 42.6,48.22 45.12,48.22 45.12,48.43 43.85,48.43 43.85,49.82
BRB2
  pour Top (no thermals): 18.73,64.09 18.73,65.69 21.24,65.69 21.24,65.49 19.97,65.49 19.97,64.09
BRB3
  pour Top (no thermals): 18.73,44.78 18.73,46.38 21.24,46.38 21.24,46.18 19.97,46.18 19.97,44.78
BRB4
  pour Top (no thermals): 18.73,6.43 18.73,8.03 21.24,8.03 21.24,7.83 19.97,7.83 19.97,6.43
BRB5
  pour Top (no thermals): 18.73,25.48 18.73,27.08 21.24,27.08 21.24,26.88 19.97,26.88 19.97,25.48
BRB7
  pour Top (no thermals): 42.35,63.83 42.35,65.43 44.86,65.43 44.86,65.23 43.59,65.23 43.59,63.83
BRB9
  pour Top (no thermals): 42.6,44.78 42.6,46.38 45.12,46.38 45.12,46.18 43.85,46.18 43.85,44.78
CLK_A
  Top 0.203: IC2.13 26.42,67.61 27.15,66.88 R21.2
CLK_B
  Top 0.203: IC4.13 26.42,48.31 27.15,47.57 R40.2
CLK_C
  Top 0.203: IC7.13 26.42,29 27.15,28.27 R55.2
CLK_D
  Top 0.203: IC6.13 26.42,9.95 27.15,9.22 R46.2
CLK_E
  Top 0.203: IC10.13 50.04,67.36 50.77,66.62 R78.2
CLK_F
  Top 0.203: IC12.13 50.29,48.31 51.03,47.57 R90.2
CONVEYER-BOARD-STOP
  Top 0.203: J4.2 53.11,36.1 53.11,38.05 53.86,38.8 55.31,38.8 57.1,40.59 57.1,43.41 57.43,43.74 58.19,43.74 59.36,42.57 IC1.92
CONVEYER-DOWN-IN  (via drill 0.3)
  Top 0.203: IC1.90 61.82,43.57 v61.86,43.53 | v61.17,37.19 61.17,37.55 62.23,38.61 v62.23,40.39
  Bottom 0.203: J4.3 54.45,34.8 55.68,36.04 57.74,36.04 58.89,37.19 v61.17,37.19 | v61.86,43.53 61.32,42.99 61.32,41.68 62.23,40.77 v62.23,40.39
CONVEYER-IN-SENSE  (via drill 0.3)
  Top 0.203: IC1.21 71.9,35.58 v71.63,35.31
  Bottom 0.203: v71.63,35.31 71.63,34.05 68.66,31.07 68.66,14.55 65.68,11.58 J10.6
CONVEYER-MOTOR-1A  (via drill 0.3)
  Top 0.203: v67.28,21.72 67.79,21.21 U3.P$10 | v68.86,54.52 67.59,54.52 67.18,54.1 66.42,54.1 65.4,53.09 IC1.68 | v72.71,41.6 72,40.89 69.69,40.89 v69.69,40.9
  Bottom 0.203: v68.86,54.52 69.37,54.52 69.79,54.1 76.21,54.1 79.76,50.56 79.76,41.91 78.99,41.15 73.7,41.15 73.25,41.6 v72.71,41.6 | v67.28,21.72 67.28,21.84 67.84,22.4 67.84,31.27 69.24,32.66 69.24,40.46 v69.69,40.9
CONVEYER-MOTOR-1B  (via drill 0.3)
  Top 0.203: v68.08,21.72 68.44,21.36 U3.P$9 | v67.98,55.63 67.98,55.54 66.94,54.5 66.31,54.5 64.9,53.09 IC1.69 | v73.22,40.59 72.83,40.2 v70.32,40.2
  Bottom 0.203: v67.98,55.63 68.25,55.36 69.2,55.36 70.1,54.46 76.36,54.46 80.11,50.7 80.11,41.76 79.14,40.79 73.42,40.79 v73.22,40.59 | v68.08,21.72 68.2,21.84 68.2,31.12 69.6,32.52 69.6,39.83 69.96,40.2 v70.32,40.2
CONVEYER-OUT1
  Top 0.406: J10.5 64.15,9.04 65.28,10.16 65.28,11.58 66.48,12.79 U3.P$5
  Bottom 0.356: J9.3 61.72,2.94 61.72,5.72 59.18,8.26 59.18,9.56 59.93,10.31 60.98,10.31 62.25,9.04 J10.5
CONVEYER-OUT2
  Top 0.406: J10.3 62.26,7.23 63.9,7.23 66.09,9.42 66.09,11.2 67.79,12.9 67.79,14.72 U3.P$7
  Bottom 0.356: J10.3 64.26,5.23 64.26,2.94 J9.5
CONVEYER-OUT-SENSE  (via drill 0.3)
  Top 0.203: J9.6 63.61,4.83 v65.53,4.83 | v73.46,35.31 73.4,35.36 IC1.24
  Bottom 0.203: v73.46,35.31 73.43,35.31 69.01,30.89 69.01,14.41 65.53,10.93 v65.53,4.83
CONVEYER-UP-OUT  (via drill 0.3)
  Top 0.203: IC1.91 61.48,43.07 v61.88,42.67 | v64.66,39.36 v64.65,39.36 63.6,39.36 v62.96,40
  Bottom 0.203: J4.4 57.4,34.8 59.18,36.58 61.59,36.58 64.36,39.36 v64.66,39.36 | v61.88,42.67 61.83,42.62 61.83,42.04 62.96,40.9 v62.96,40
CONVEYER_SOLENOID  (via drill 0.3)
  Top 0.203: v64.7,40.28 64.44,40.03 63.78,40.03 62.74,41.07 IC1.95 | v7.87,28.45 7.87,27.01 R22.1
  Bottom 0.203: v64.7,40.28 63.27,38.86 48.01,38.86 46.99,37.85 30.13,37.85 29.61,38.37 22.86,38.37 18.78,34.29 12.68,34.29 7.87,29.49 v7.87,28.45
CPI2
  Top 0.203: IC2.5 23.93,62.53 C48.2
CPI3
  Top 0.203: IC4.5 23.93,43.23 C61.2
CPI4
  Top 0.203: IC6.5 23.93,4.88 C69.2
CPI6
  Top 0.203: IC7.5 23.93,23.93 C77.2
CPI8
  Top 0.203: IC10.5 47.55,62.28 C91.2
CPI10
  Top 0.203: IC12.5 47.8,43.99 48.92,42.88 C105.2
CPO2
  Top 0.203: C48.1 24.09,60.67 24.09,61.87 23.43,62.53 IC2.4
CPO3
  Top 0.203: C61.1 24.09,41.37 24.09,42.56 23.43,43.23 IC4.4
CPO4
  Top 0.203: C69.1 24.09,3.01 24.09,4.21 23.43,4.87 IC6.4
CPO6
  Top 0.203: C77.1 24.09,22.06 24.09,23.26 23.43,23.92 IC7.4
CPO8
  Top 0.203: C91.1 47.72,60.41 47.72,61.61 47.05,62.28 IC10.4
CPO10
  Top 0.203: C105.1 47.97,41.37 47.97,42.82 47.3,43.48 IC12.4
D5_N
  Top 0.203: U$44.30 83.57,18.54 arc-90 84.07,18.04 84.07,16.92 arc90 86.61,14.38 | 86.61,14.38 88.65,14.38 arc90 90.78,16.51 90.78,21.34 arc45 90.32,22.45 87.36,25.41 arc-45 86.61,27.21 86.61,28.45 arc-90 87.63,29.46 arc90 89.66,31.5 89.66,32 arc90 88.53,33.13 86.63,33.13 arc90 U$11.D- | U$58.2 86.61,13.86 86.61,14.38
D5_P
  Top 0.203: U$44.31 83.57,19.04 arc-90 84.43,18.18 84.43,16.92 arc90 86.61,14.73 | 86.61,14.73 88.65,14.73 arc90 90.42,16.51 90.42,17.02 arc90 90.13,17.31 89.21,17.31 arc-90 88.92,17.6 88.92,17.66 arc-90 89.21,17.96 90.13,17.96 arc90 90.42,18.25 90.42,18.31 arc90 90.13,18.6 89.21,18.6 arc-90 88.92,18.9 88.92,18.96 arc-90 89.21,19.25 90.13,19.25 arc90 90.42,19.54 90.42,19.61 arc90 90.13,19.9 89.21,19.9 arc-90 88.92,20.19 88.92,20.25 arc-90 89.21,20.55 90.13,20.55 arc90 90.42,20.84 90.42,21.34 arc45 90.07,22.2 87.11,25.16 arc-45 86.26,27.21 86.26,29.73 arc-45 87,31.53 U$11.D+ | U$59.2 86.63,14.75 86.61,14.73
DIR1  (via drill 0.3)
  Top 0.203: IC2.19 22.93,70.8 v22.86,70.87 | IC1.85 61.72,46.07 62.2,45.6 62.2,44.73 63.34,43.59 65.19,43.59 66.97,45.37 66.97,46.34 65.9,47.41 v65.9,47.62
  Bottom 0.203: v22.86,70.87 23.37,71.37 31.49,71.37 33.4,69.46 33.4,61.59 34.04,60.96 36.3,60.96 38.2,59.05 45.16,59.05 45.95,59.84 54.22,59.84 65.78,48.28 65.78,47.74 v65.9,47.62
DIR2  (via drill 0.3)
  Top 0.203: IC4.19 22.93,51.38 v23.11,51.56 | v65.02,46.2 65.02,45.99 65.58,45.44 65.58,44.98 64.89,44.3 63.63,44.3 62.92,45.01 62.92,47.31 61.66,48.57 IC1.80
  Bottom 0.203: v65.02,46.2 64.96,46.2 64.43,46.73 64.43,48.12 53.88,58.67 48.79,58.67 47.88,57.76 47.12,57.76 46.89,57.99 38.25,57.99 37.26,57 34.3,57 32.66,55.36 30.81,55.36 30.24,54.79 30.24,52.93 29.83,52.53 24.06,52.53 23.11,51.58 v23.11,51.56
DIR3  (via drill 0.3)
  Top 0.203: IC7.19 22.93,32.58 v23.11,32.77 | v71.72,48.7 71.56,48.53 70.65,48.53 65.36,43.23 64.52,43.23 64.3,43.02 v64.12,43.02 | v71.39,50.38 71.03,50.38 70.4,51.01 IC1.58
  Bottom 0.203: v23.11,32.77 23.62,33.27 24.64,33.27 25.04,32.87 31.39,32.87 34.28,29.97 46.75,29.97 50.1,33.33 57.91,33.33 59.49,34.9 61.99,34.9 65.28,38.19 65.28,40.64 64.54,41.37 64.54,42.6 v64.12,43.02 | v71.72,48.7 71.39,49.02 v71.39,50.38
DIR4  (via drill 0.3)
  Top 0.203: IC6.19 22.93,13.02 v23.11,13.21 | IC1.56 71.4,51.31 71.43,51.29 72.02,51.29 v72.93,50.38 | v67.26,42.16 67.51,42.42 67.51,43.38 71.21,47.07 73.04,47.07 v73.04,47.24
  Bottom 0.203: v23.11,13.21 24.64,14.73 25.39,14.73 36.22,3.91 52.43,3.91 53.85,5.33 53.85,11.21 56.48,13.85 58.93,13.85 59.37,14.29 59.37,19.5 60.71,20.84 62.14,20.84 63.59,22.29 63.59,32.13 68.17,36.72 68.17,41.25 v67.26,42.16 | v72.93,50.38 73.04,50.27 v73.04,47.24
DIR5  (via drill 0.3)
  Top 0.203: IC10.19 46.55,70.93 46.99,71.37 48.72,71.37 v49.02,71.07 | IC1.49 74.3,50.07 74.04,49.82 70.94,49.82 69.32,48.2 68.49,48.2 v68.24,48.46
  Bottom 0.203: v68.24,48.46 68.06,48.28 67.6,48.28 66.92,48.96 66.64,48.96 56.64,58.96 56.64,66.4 51.6,71.44 49.39,71.44 v49.02,71.07 48.62,71.48 35.26,71.48 34.8,71.02 J8.4
DIR6  (via drill 0.3)
  Top 0.203: IC12.19 46.8,51.13 v46.91,51.24 45.32,52.83 35.83,52.83 35.05,52.05 J7.4 | IC1.93 62.52,42.07 v63.02,42.57
  Bottom 0.203: v63.02,42.57 62.81,42.77 62.81,44.12 62.36,44.58 61.21,44.58 60.63,45.16 57.62,45.16 51.42,51.36 47.03,51.36 v46.91,51.24
EN1  (via drill 0.3)
  Top 0.203: IC2.2 22.43,62.03 R26.2 22.1,60.55 22.1,58.93 22.67,58.36 v22.67,58.18 | v64.99,46.95 65.05,46.95 65.58,46.43 65.58,46.03 66.04,45.58 66.04,44.94 65.04,43.94 63.49,43.94 62.57,44.87 62.57,47.17 61.66,48.07 IC1.81
  Bottom 0.203: v64.99,46.95 64.99,48.06 53.97,59.08 48.69,59.08 47.73,58.12 47.27,58.12 47.04,58.34 38.1,58.34 37.87,58.12 22.73,58.12 v22.67,58.18
EN2  (via drill 0.3)
  Top 0.203: IC4.2 22.43,42.73 R42.2 22.1,41.25 22.1,39.62 22.96,38.76 27.33,38.76 27.69,39.12 v30.48,39.12 | IC1.59 69.9,55.06 68.76,56.2 62.34,56.2 61.35,55.21 61.35,51.44 61.77,51.02 61.77,49.44 v61.66,49.33
  Bottom 0.203: v61.66,49.33 61.15,49.84 57.33,49.84 55.46,51.71 47.6,51.71 47.4,51.91 41.3,51.91 38.61,54.61 36.35,54.61 35.77,54.03 35.77,53.49 35.41,53.14 34.24,53.14 33.36,52.25 33.36,42.91 34.83,41.44 34.83,39.61 33.7,38.48 31.11,38.48 v30.48,39.12
EN3  (via drill 0.3)
  Top 0.203: IC7.2 22.43,23.43 R57.2 v22.11,22.85 v22.1,22.86 | IC1.57 70.9,51.31 71.28,50.93 71.62,50.93 72.15,50.41 v72.15,50.38 | v72.48,48.76 72.48,48.66 71.95,48.14 70.76,48.14 65.92,43.3 v65.92,43
  Bottom 0.203: v22.1,22.86 29.03,22.86 30.08,21.81 40.86,21.81 43.94,24.89 44.96,24.89 45.72,25.65 45.72,26.93 50.69,31.9 58.5,31.9 60.08,33.48 62.58,33.48 66.7,37.6 66.7,42.22 v65.92,43 | v72.15,50.38 72.48,50.05 v72.48,48.76
EN4  (via drill 0.3)
  Top 0.203: IC6.2 22.43,4.38 R48.2 21.65,2.45 21.65,1.46 v21.69,1.42 | v67.53,46.29 66.46,47.36 66.46,47.85 65.9,48.4 IC1.67
  Bottom 0.203: v21.69,1.42 21.95,1.17 34.19,1.17 36.22,3.2 52.73,3.2 54.61,5.08 54.61,10.93 56.79,13.11 59.23,13.11 60.08,13.95 60.08,19.19 61.02,20.13 62.44,20.13 64.3,21.99 64.3,31.84 68.89,36.42 68.89,41.9 67.49,43.3 67.49,46.25 v67.53,46.29
EN5  (via drill 0.3)
  Top 0.203: IC10.2 46.05,61.78 R80.2 45.77,60.35 v45.72,60.4 45.72,60.44 45.33,60.83 39.11,60.83 v38.31,60.03 | IC1.48 74.38,49.57 74.27,49.47 71.08,49.47 68.48,46.87 67.59,46.87 67.07,47.39 v67.07,47.57
  Bottom 0.203: v67.07,47.57 66.79,47.85 66.46,47.85 66.13,48.17 66.13,48.43 54.36,60.2 45.92,60.2 v45.72,60.4 | v38.31,60.03 38.51,60.23 38.51,65.63 37.81,66.33 36.11,66.33 J8.2
EN6  (via drill 0.3)
  Top 0.203: IC12.2 46.3,42.73 R92.2 45.97,41.25 45.97,39.7 46.27,39.4 46.96,39.4 v47.24,39.12 | IC1.94 62.81,41.57 63.76,40.63 v63.97,40.63
  Bottom 0.203: v63.97,40.63 63.97,40.12 63.07,39.22 47.86,39.22 47.76,39.12 v47.24,39.12 46.74,38.61 42.42,38.61 41.4,39.62 41.4,40.66 39.62,42.44 39.62,44.05 38.73,44.95 36.34,44.95 J7.2
ENDSTOP1  (via drill 0.3)
  Top 0.203: IC1.63 67.9,50.89 67.48,50.46 67.48,49.19 v67.58,49.09 | D7.A 10.16,53.14 v10.16,53.59 | C86.4 3.62,68.64 6.11,66.16 6.11,62.12 6.76,61.47 9.14,61.47 11.06,59.55 v11.06,58.17 11.06,57.38 RN1.16
  Bottom 0.203: v67.58,49.09 67.35,49.32 66.8,49.32 57,59.12 57,66.55 51.71,71.83 13.37,71.83 12.07,70.53 12.07,59.18 v11.06,58.17 11.06,57.82 10.16,56.92 v10.16,53.59
ENDSTOP2  (via drill 0.3)
  Top 0.203: IC1.62 68.4,50.88 67.84,50.31 67.84,49.65 68.37,49.12 68.85,49.12 v68.99,48.98 | v9.91,51.05 9.91,50.35 D2.A | RN1.14 9.89,57.57 10.3,57.99 v10.3,58.92 10.3,59.55 8.74,61.11 6.62,61.11 5.75,61.98 5.75,65.75 3.75,67.75 C86.3
  Bottom 0.203: v68.99,48.98 68.86,49.1 68.38,49.1 67.81,49.67 66.96,49.67 57.35,59.28 57.35,66.69 51.86,72.19 13.23,72.19 11.72,70.68 11.72,60.34 v10.3,58.92 10.3,57.98 9.6,57.28 9.6,51.36 v9.91,51.05
ENDSTOP3  (via drill 0.3)
  Top 0.203: IC1.61 68.9,50.62 68.39,50.11 v68.39,49.91 | D5.A 9.65,47.55 v9.65,48.51 | RN1.12 9.39,58.01 v9.54,58.17 9.54,59.55 8.33,60.76 6.47,60.76 5.4,61.83 5.4,65.09 3.62,66.86 C86.2
  Bottom 0.203: v68.39,49.91 68.22,50.08 67.05,50.08 57.71,59.42 57.71,66.84 52.01,72.54 13.08,72.54 11.36,70.83 11.36,60.77 9.54,58.95 v9.54,58.17 9.25,57.87 9.25,48.92 v9.65,48.51
ENDSTOP4  (via drill 0.3)
  Top 0.203: v69.21,49.91 69.4,50.1 IC1.60 | v8.79,58.92 8.84,58.87 | 8.84,58.87 8.89,58.82 RN1.10 | D6.A 9.65,45.01 v9.65,45.97 | 8.84,58.87 8.84,59.64 8.07,60.4 6.32,60.4 5.04,61.68 5.04,64.18 3.25,65.98 C86.1
  Bottom 0.203: v69.21,49.91 68.65,50.46 67.17,50.46 58.06,59.57 58.06,66.99 52.16,72.9 12.93,72.9 11.01,70.97 11.01,60.92 9.01,58.92 v8.79,58.92 8.79,46.84 v9.65,45.97
ENDSTOP5  (via drill 0.3)
  Top 0.203: IC1.26 73.77,38.57 v73.41,38.94 | v9.65,43.43 9.65,42.46 D8.A | RN1.8 8.39,57.81 v8.03,58.17 8.03,59.89 7.87,60.05 6.18,60.05 4.69,61.54 4.69,63.5 3.86,64.33 C85.4
  Bottom 0.203: v73.41,38.94 73.41,39.12 69.77,42.76 69.77,50.14 69.08,50.82 67.32,50.82 58.42,59.72 58.42,67.14 52.3,73.25 12.79,73.25 10.65,71.12 10.65,61.3 9.22,59.87 8.95,59.87 8.03,58.95 v8.03,58.17 8.03,57.91 8.43,57.51 8.43,45.42 9.65,44.2 v9.65,43.43
ENDSTOP6  (via drill 0.3)
  Top 0.203: IC1.27 74.22,39.07 v74.16,39.13 | v9.65,40.89 9.65,39.92 D9.A | RN1.6 7.89,57.26 7.27,57.88 v7.27,58.92 7.27,59.28 6.86,59.69 6.03,59.69 4.33,61.39 4.33,62.99 3.89,63.44 C85.3
  Bottom 0.203: v74.16,39.13 74.13,39.13 73.76,39.49 73.53,39.49 70.12,42.9 70.12,50.28 69.23,51.17 67.47,51.17 58.78,59.87 58.78,67.28 52.45,73.61 12.64,73.61 10.3,71.27 10.3,61.58 8.95,60.22 8.57,60.22 v7.27,58.92 7.27,57.75 8.07,56.95 8.07,43.74 9.65,42.16 v9.65,40.89
ENDSTOP7  (via drill 0.3)
  Top 0.203: v72.89,43.76 72.89,43.57 IC1.36 | D10.A 11.94,37.37 v11.94,38.35 | RN1.4 7.39,57.09 6.58,57.9 v6.58,58.15 6.58,59.11 6.35,59.33 5.88,59.33 3.98,61.24 3.98,62.23 3.66,62.55 C85.2
  Bottom 0.203: v72.89,43.76 72.89,43.95 70.48,46.36 70.48,50.43 69.38,51.53 67.64,51.53 59.13,60.04 59.13,67.43 52.6,73.97 12.49,73.97 9.94,71.42 9.94,61.86 8.66,60.58 8.14,60.58 6.58,59.02 v6.58,58.15 6.58,57.81 7.72,56.67 7.72,40.54 9.91,38.35 v11.94,38.35
ENDSTOP8  (via drill 0.3)
  Top 0.203: IC1.37 74.04,44.07 73.66,44.45 v73.41,44.45 | v11.94,35.81 11.94,34.83 D11.A | C85.1 3.2,61.51 5.76,58.96 v5.76,58.67 5.91,58.52 5.91,57.69 RN1.2
  Bottom 0.203: v73.41,44.45 70.83,47.02 70.83,50.58 69.53,51.88 67.79,51.88 59.49,60.19 59.49,67.58 52.74,74.32 12.34,74.32 9.58,71.56 9.58,62.21 8.59,61.21 8.05,61.21 5.76,58.92 v5.76,58.67 5.9,58.53 5.9,57.86 7.36,56.39 7.36,40.39 v11.94,35.81
ENET_MDC  (via drill 0.3)
  Top 0.203: v54.64,50.15 54.08,50.71 54.08,51.96 53.4,52.64 52.73,52.64 J5.7 | IC1.87 58.81,45.07 58.4,45.49 58.4,45.96 v57.84,46.52
  Bottom 0.203: v57.84,46.52 55.35,49 55.35,49.43 v54.64,50.15
ENET_MDIO  (via drill 0.3)
  Top 0.203: v57.8,47.36 57.9,47.36 58.51,46.75 58.51,46.48 59.41,45.57 IC1.86 | J5.9 54.64,53.28 v54.64,51.05
  Bottom 0.203: v57.8,47.36 56.02,49.14 56.02,49.77 54.74,51.05 v54.64,51.05
ENET_REF_CLK  (via drill 0.3)
  Top 0.203: IC1.88 58.69,44.57 57.84,45.42 v57.84,45.73 | v54.64,49.24 54.63,49.24 53.82,50.05 52.67,50.05 52.34,50.38 52.34,51.75 51.68,52.41 50.8,52.41 49.11,54.1 J5.5
  Bottom 0.203: v57.84,45.73 54.64,48.93 v54.64,49.24
GND  (via drill 0.3)  (496 unrouted)
  Top 0.203: C67.1 C8.1 92.03,44.16 92.96,44.16 v93.98,45.17 U$12.PIN6 | U$50.1 73.39,24.07 U$15.1 72.98,24.21 v72.64,23.88 | C9.1 71.15,54.83 v70.36,55.63 | v57.76,50.85 C12.1 57.77,50.2 58.96,49 58.96,47.33 59.22,47.07 IC1.83 | C11.1 78.61,44.84 v78.99,44.45 | C17.1 78.81,36.76 v78.99,36.58 | C4.1 v84.07,38.6 v84.07,38.61 | C5.1 80.01,31.19 v80.01,30.73 | R69.1 82.8,25.92 v82.8,27.18 | C51.2 87.64,22.59 v88.14,22.1 | C32.2 77.72,14.22 v76.96,14.22 | U$44.22 79.3,19.04 U$44.37 80.3,19.04 U$44.24 | C72.2 85.6,17.21 v85.6,16 | R70.1 83.78,14.27 84.33,13.72 v84.33,13.46 | IC5.16 43.87,33.27 44.2,33.6 v44.2,34.04 | C58.1 41.2,32.05 40.5,31.36 v40.5,31 | C7.1 57.2,39.87 v57.16,39.87 | R25.2 61.41,60.73 v60.74,60.73 60.71,60.76 v60.71,61.98 | IC1.72 63.4,54.41 C20.1 63.96,55.63 v66.04,55.63 | IC8.7 37.85,25.02 v37.85,24.13 | IC1.31 74.78,41.07 74.31,41.55 74.31,41.83 v74.07,42.07 | IC1.41 74.77,46.07 74.17,46.67 v74.17,47.24 | U3.P$13 65.82,20.34 65.82,21.95 66.27,22.4 v66.9,22.4 68.02,23.52 C55.2 66.11,25.57 C56.2 | C16.1 33.53,33.07 v33.53,33.78 | IC8.16 36.49,29.43 v36.32,29.26 | IC5.13 45.82,29.26 v45.47,29.26 | v42.55,26.1 42.57,26.07 IC5.3 | v70.52,39.15 70.36,38.99 SUPPLY10.P$2 | R72.1 20.32,2.54 v20.57,2.29
  Top 0.406: U$20.P$2 80.52,56.98 v80.52,55.88 | U$13.P$2 80.77,50.09 v80.77,49.28 | U$27.P$2 85.16,68.14 v85.09,68.07 | U$30.P$2 7.69,22.16 v7.62,22.1 | U$32.P$2 29.24,34.29 v29.46,34.29 | U$34.P$2 12.37,1.76 v12.37,0.9
  other vias: 16.26,19.81 15.24,19.81 14.22,19.81 16.26,16.76 15.24,16.76 14.22,16.76 2.03,11.43 3.05,11.43 4.06,11.43 4.06,8.38 3.05,8.38 2.03,8.38 16.26,36.07 15.24,36.07 14.22,36.07 16.26,39.12 15.24,39.12 14.22,39.12 16.26,55.12 15.24,55.12 14.22,55.12 14.22,58.17 15.24,58.17 16.26,58.17 40.64,39.62 39.62,39.62 38.61,39.62 40.64,36.58 39.62,36.58 38.61,36.58 36.83,58.67 35.81,58.67 34.8,58.67 36.83,55.63 35.81,55.63 34.8,55.63 22.17,67.85 22.98,67.85 23.8,67.85 24.61,67.85 24.61,67.04 23.8,67.04 22.98,67.04 22.17,67.04 22.17,66.23 22.98,66.23 23.8,66.23 24.61,66.23 24.61,65.42 23.8,65.42 22.98,65.42 22.17,65.42 22.17,48.55 22.98,48.55 23.8,48.55 24.61,48.55 24.61,47.74 23.8,47.74 22.98,47.74 22.17,47.74 22.17,46.92 22.98,46.92 23.8,46.92 24.61,46.92 24.61,46.11 23.8,46.11 22.98,46.11 22.17,46.11 46.05,48.55 46.86,48.55 47.67,48.55 48.48,48.55 48.48,47.74 47.67,47.74 46.86,47.74 46.05,47.74 46.05,46.92 46.86,46.92 47.67,46.92 48.48,46.92 48.48,46.11 47.67,46.11 46.86,46.11 46.05,46.11 45.79,67.6 46.61,67.6 47.42,67.6 48.23,67.6 48.23,66.79 47.42,66.79 46.61,66.79 45.79,66.79 45.79,65.97 46.61,65.97 47.42,65.97 48.23,65.97 48.23,65.16 47.42,65.16 46.61,65.16 45.79,65.16 22.17,29.25 22.98,29.25 23.8,29.25 24.61,29.25 24.61,28.43 23.8,28.43 22.98,28.43 22.17,28.43 22.17,27.62 22.98,27.62 23.8,27.62 24.61,27.62 24.61,26.81 23.8,26.81 22.98,26.81 22.17,26.81 22.17,10.2 22.98,10.2 23.8,10.2 24.61,10.2 24.61,9.38 23.8,9.38 22.98,9.38 22.17,9.38 22.17,8.57 22.98,8.57 23.8,8.57 24.61,8.57 24.61,7.76 23.8,7.76 22.98,7.76 22.17,7.76 17.2,12.11 17.19,12.75 17.2,5.12 17.2,5.8 30.57,4.51 30.57,3.57 17.2,31.16 17.19,31.8 17.2,24.17 17.2,24.85 30.57,23.56 30.57,22.62 41.08,50.46 41.06,51.11 41.08,43.48 41.08,44.15 54.44,42.86 54.44,41.92 17.2,69.77 17.19,70.41 17.2,62.78 17.2,63.45 30.57,62.16 30.57,61.22 40.83,69.51 40.81,70.16 40.83,62.53 40.82,63.2 54.19,61.91 54.19,60.97 17.2,50.46 17.19,51.11 17.2,43.48 17.2,44.15 30.57,42.86 30.57,41.92 61.13,64.48 61.77,64.48 63.42,64.48 73.05,59.41 73.68,59.41 72.41,59.41 74.57,59.41 75.21,59.41 75.84,59.41 81.2,70.83 81.2,70.19 81.2,69.56 81.2,68.92 62.53,71.97 63.42,71.97 64.31,71.97 69.34,60.71 69.34,59.94 93.73,36.32 96.27,32.77 69.77,13.67 69.77,15.16 69.77,16.65 69.77,18.14 69.77,19.63 69.77,21.13 69.77,22.62 69.77,24.11 69.77,25.6 70.1,26.92 70.87,27.94 72.14,28.7 73.66,28.96 77.93,26.57 76.71,26.67 80.39,27.97 73.66,22.1 73.91,16.76 76.71,22.35 35.56,27.18 40.64,28.96 46.48,26.67 81.32,21.02 80.57,21.02 79.82,21.02 79.06,21.02 78.31,21.02 78.31,18.03 79.06,18.03 79.82,18.03 80.57,18.03 81.32,18.03 81.32,18.78 80.57,18.78 79.82,18.78 79.06,18.78 78.31,18.78 78.31,19.52 78.31,20.27 79.06,20.27 79.06,19.52 79.82,19.52 79.82,20.27 80.57,20.27 80.57,19.52 81.32,19.52 81.32,20.27 59.94,71.88 59.94,70.87 59.94,69.85 59.94,68.83 50.04,29.21 49.28,20.07 53.59,20.07 55.88,23.88 40.39,55.37 49.53,26.67 48.26,20.07 47.24,20.07 54.61,20.07 55.63,20.07 56.64,20.07 53.09,22.61 53.09,23.62 53.09,24.64 21.08,34.04 25.65,33.78 97.28,43.94 97.28,49.02 96.77,54.1 98.3,54.1 49.53,25.65 49.53,24.64 49.78,23.62 46.23,20.07 1.27,65.19 2.2,65.19 90.42,13.46 91.44,14.48 91.95,16 84.84,28.45 84.84,26.92 84.84,25.4 90.93,31.24 90.93,29.97 34.04,12.7 36.58,12.7 34.04,3.05 35.31,17.78 42.93,17.53 64.26,18.29 64.26,16.76 68.07,18.29 68.07,16.76 53.09,25.65
  pour Bottom (isolate 0.203, rank 4, no thermals): -10.87,81.9 -10.87,-15.09 107.59,-15.09 107.59,81.9
  pour Top (no thermals): 63.64,64.18 60.8,64.18 60.8,64.78 63.64,64.78
  pour Top (no thermals): 64.51,73.6 62.37,73.6 62.37,71.57 64.51,71.57
  pour Top (no thermals): 30.91,60.96 30.91,62.5 28.52,62.5 28.52,60.96
  pour GND (rank 5, no thermals): -11.68,83.17 108.26,83.17 108.26,-16.13 -11.68,-16.13
  pour Top (no thermals): 16.86,65.62 16.86,62.32 18.89,62.32 18.89,63.71 18,63.71 18,65.62
  pour Top (no thermals): 16.86,67.65 18,67.65 18,69.44 18.89,69.44 18.89,70.83 16.86,70.83
  pour Top (rank 3, no thermals): -9.65,80.63 106.61,80.63 106.61,-13.97 -9.65,-13.97
  pour Top (no thermals): 30.91,41.66 30.91,43.19 28.52,43.19 28.52,41.66
  pour Top (no thermals): 16.86,46.31 16.86,43.01 18.89,43.01 18.89,44.41 18,44.41 18,46.31
  pour Top (no thermals): 16.86,48.35 18,48.35 18,50.14 18.89,50.14 18.89,51.52 16.86,51.52
  pour Top (no thermals): 30.91,22.35 30.91,23.89 28.52,23.89 28.52,22.35
  pour Top (no thermals): 16.86,27.01 16.86,23.71 18.89,23.71 18.89,25.11 18,25.11 18,27.01
  pour Top (no thermals): 16.86,29.04 18,29.04 18,30.83 18.89,30.83 18.89,32.22 16.86,32.22
  pour Top (no thermals): 30.91,3.3 30.91,4.84 28.52,4.84 28.52,3.3
  pour Top (no thermals): 16.86,7.96 16.86,4.66 18.89,4.66 18.89,6.06 18,6.06 18,7.96
  pour Top (no thermals): 16.86,9.99 18,9.99 18,11.78 18.89,11.78 18.89,13.17 16.86,13.17
  pour Top (no thermals): 54.53,60.71 54.53,62.24 52.14,62.24 52.14,60.71
  pour Top (no thermals): 40.48,65.36 40.48,62.06 42.52,62.06 42.52,63.46 41.63,63.46 41.63,65.36
  pour Top (no thermals): 40.48,67.4 41.63,67.4 41.63,69.19 42.52,69.19 42.52,70.57 40.48,70.57
  pour Top (no thermals): 54.78,41.66 54.78,43.19 52.39,43.19 52.39,41.66
  pour Top (no thermals): 40.74,46.31 40.74,43.01 42.77,43.01 42.77,44.41 41.88,44.41 41.88,46.31
  pour Top (no thermals): 40.74,48.35 41.88,48.35 41.88,50.14 42.77,50.14 42.77,51.52 40.74,51.52
GRIPPER-ENCODER2  (via drill 0.3)
  Top 0.203: J9.1 56.39,3.19 56.39,7.51 J10.1 57.91,9.14 56.21,10.85 56.21,12.48 57.17,13.44 57.89,13.44 59.53,15.08 59.53,22.16 58.33,23.37 58.33,31.89 61.38,34.94 61.38,35.91 60.45,36.83 60.45,37.46 61.67,38.68 v61.67,39.77 | IC1.89 58.68,44.07 58.49,44.27 v57.24,44.27
  Bottom 0.203: v57.24,44.27 57.98,44.27 61.67,40.57 v61.67,39.77
ISP_BOOT  (via drill 0.3)